# EasyEDA schematic LCEDA_schematic_esp_trans_v2.json

## Sheets
1 Sheet_1: TITLE: Sheet_1; REV: 1.0; Date: 2023-03-05; Sheet: 1/2; Drawn By: gtwhhh; Company: gtwhhh
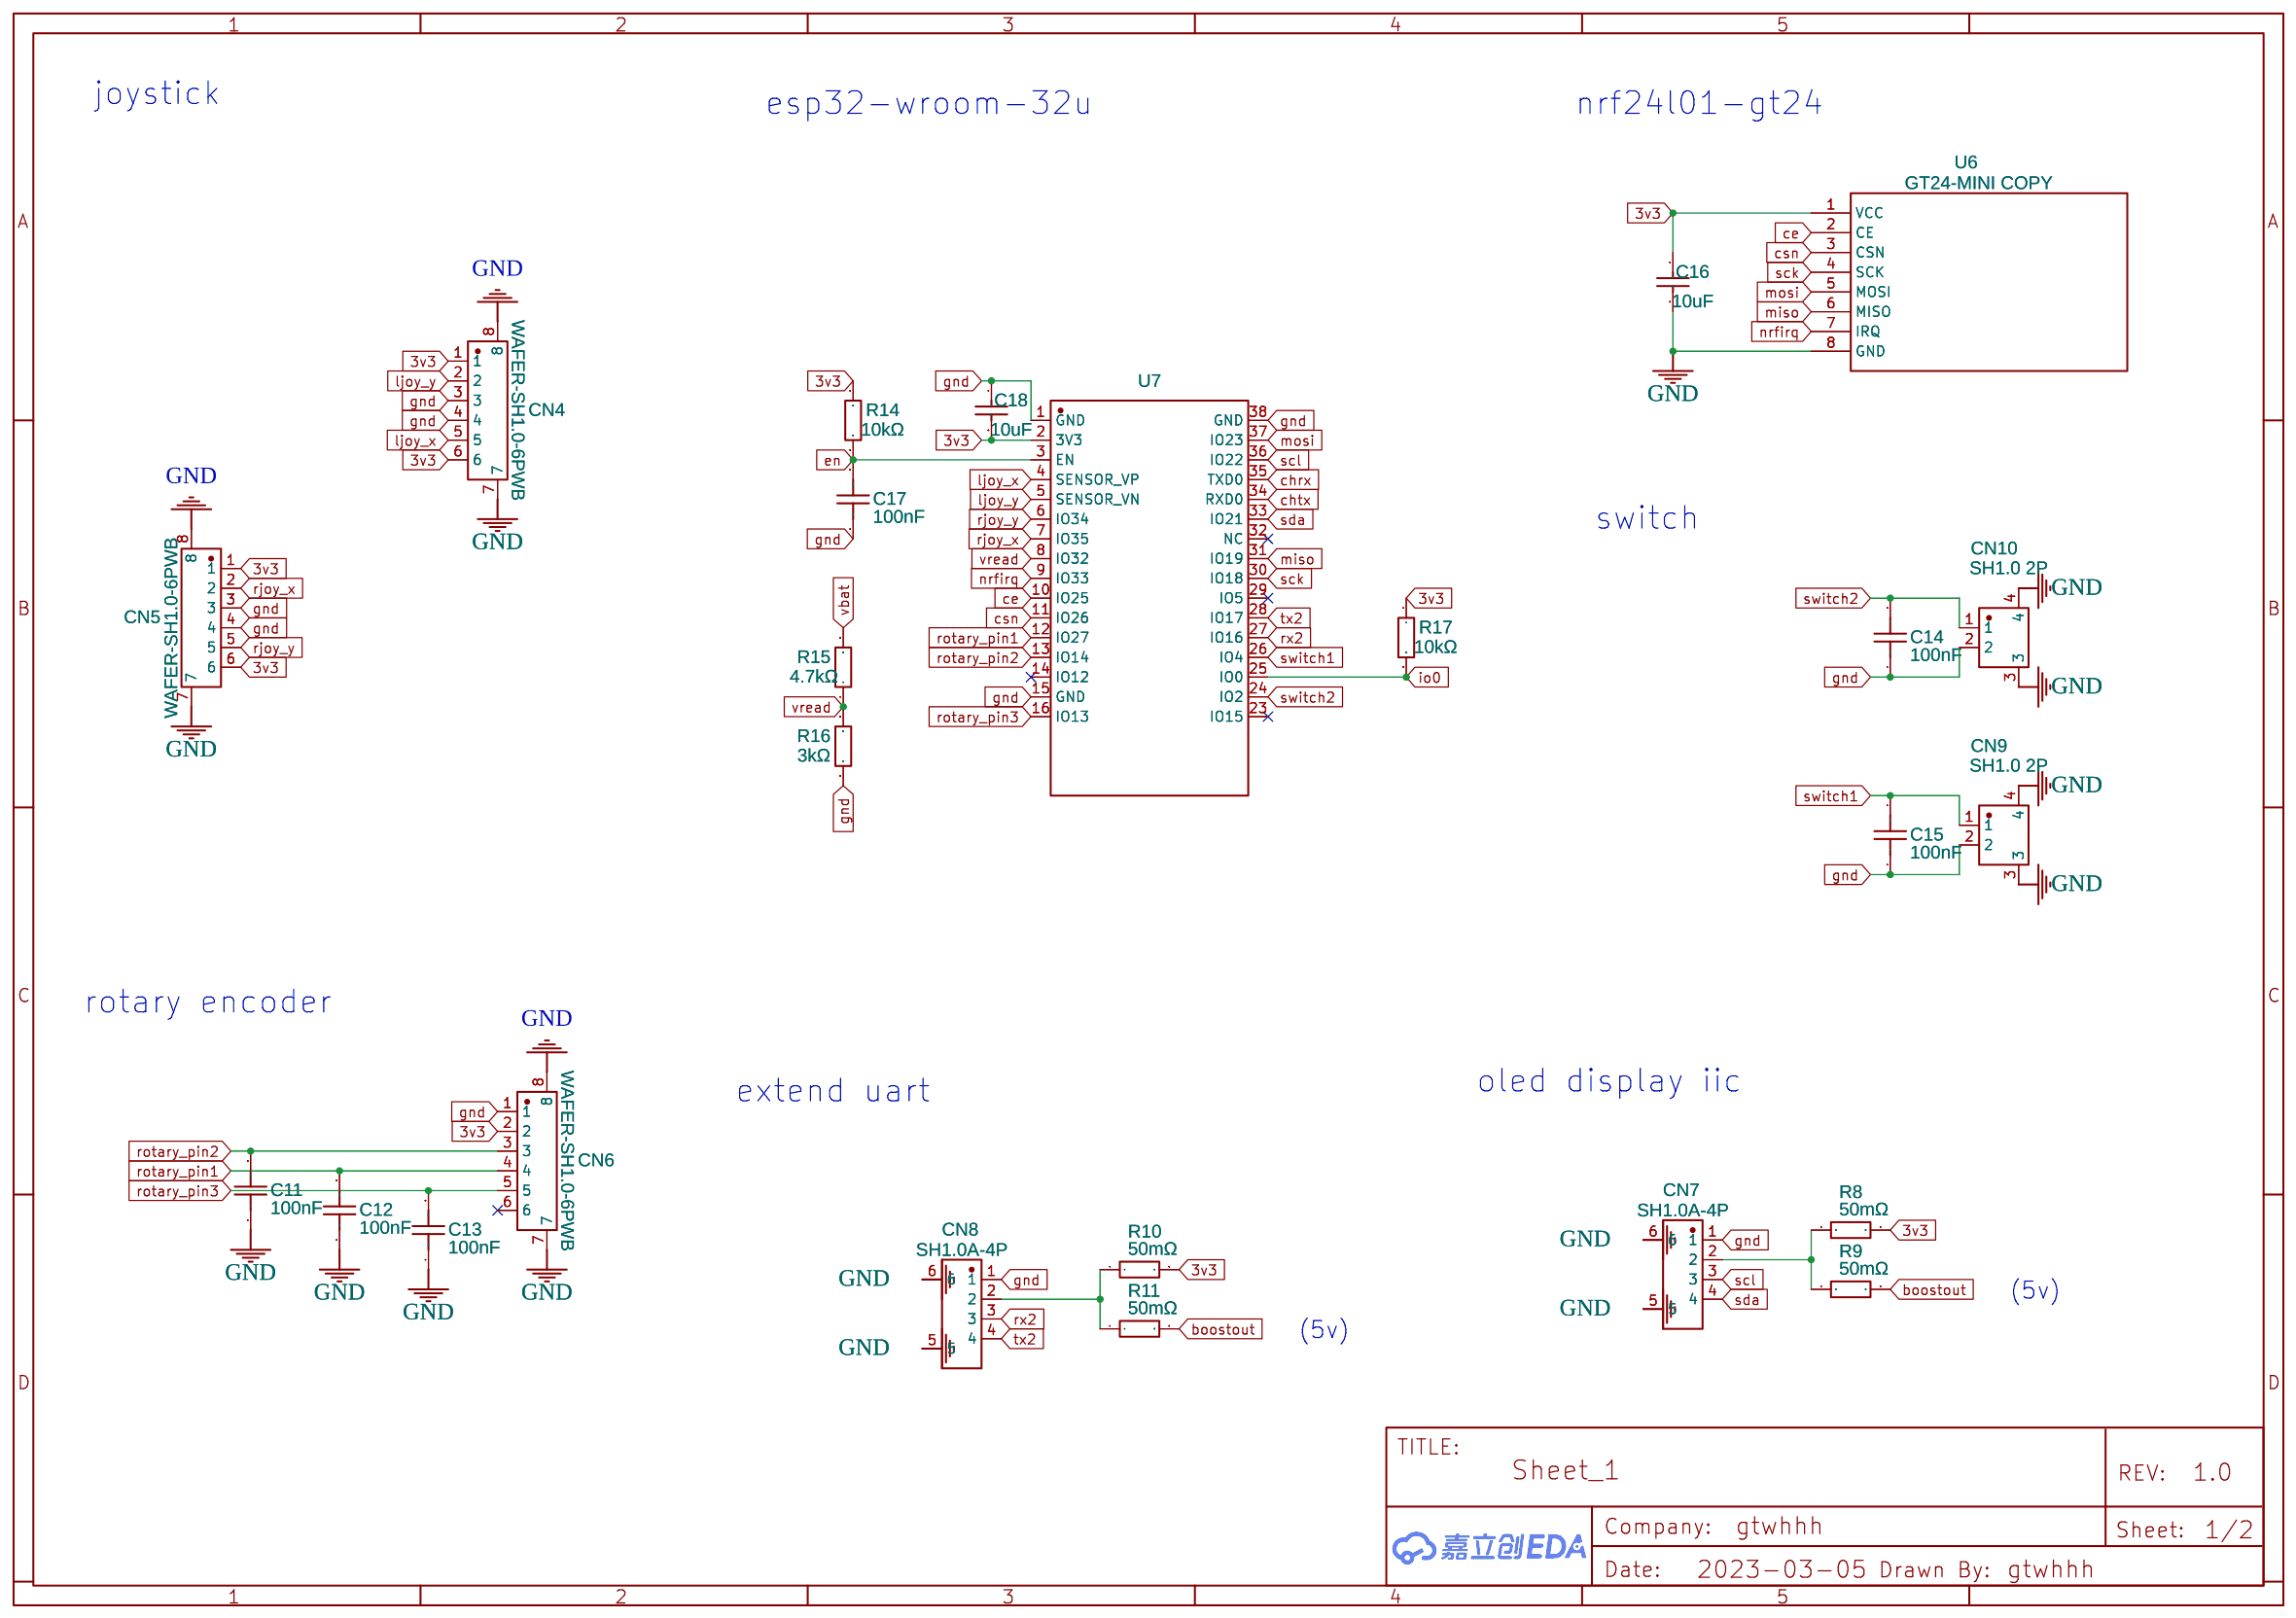
[diagram p0: Sheet_1]
2 Sheet_2: TITLE: Sheet_2; Sheet: 2/2
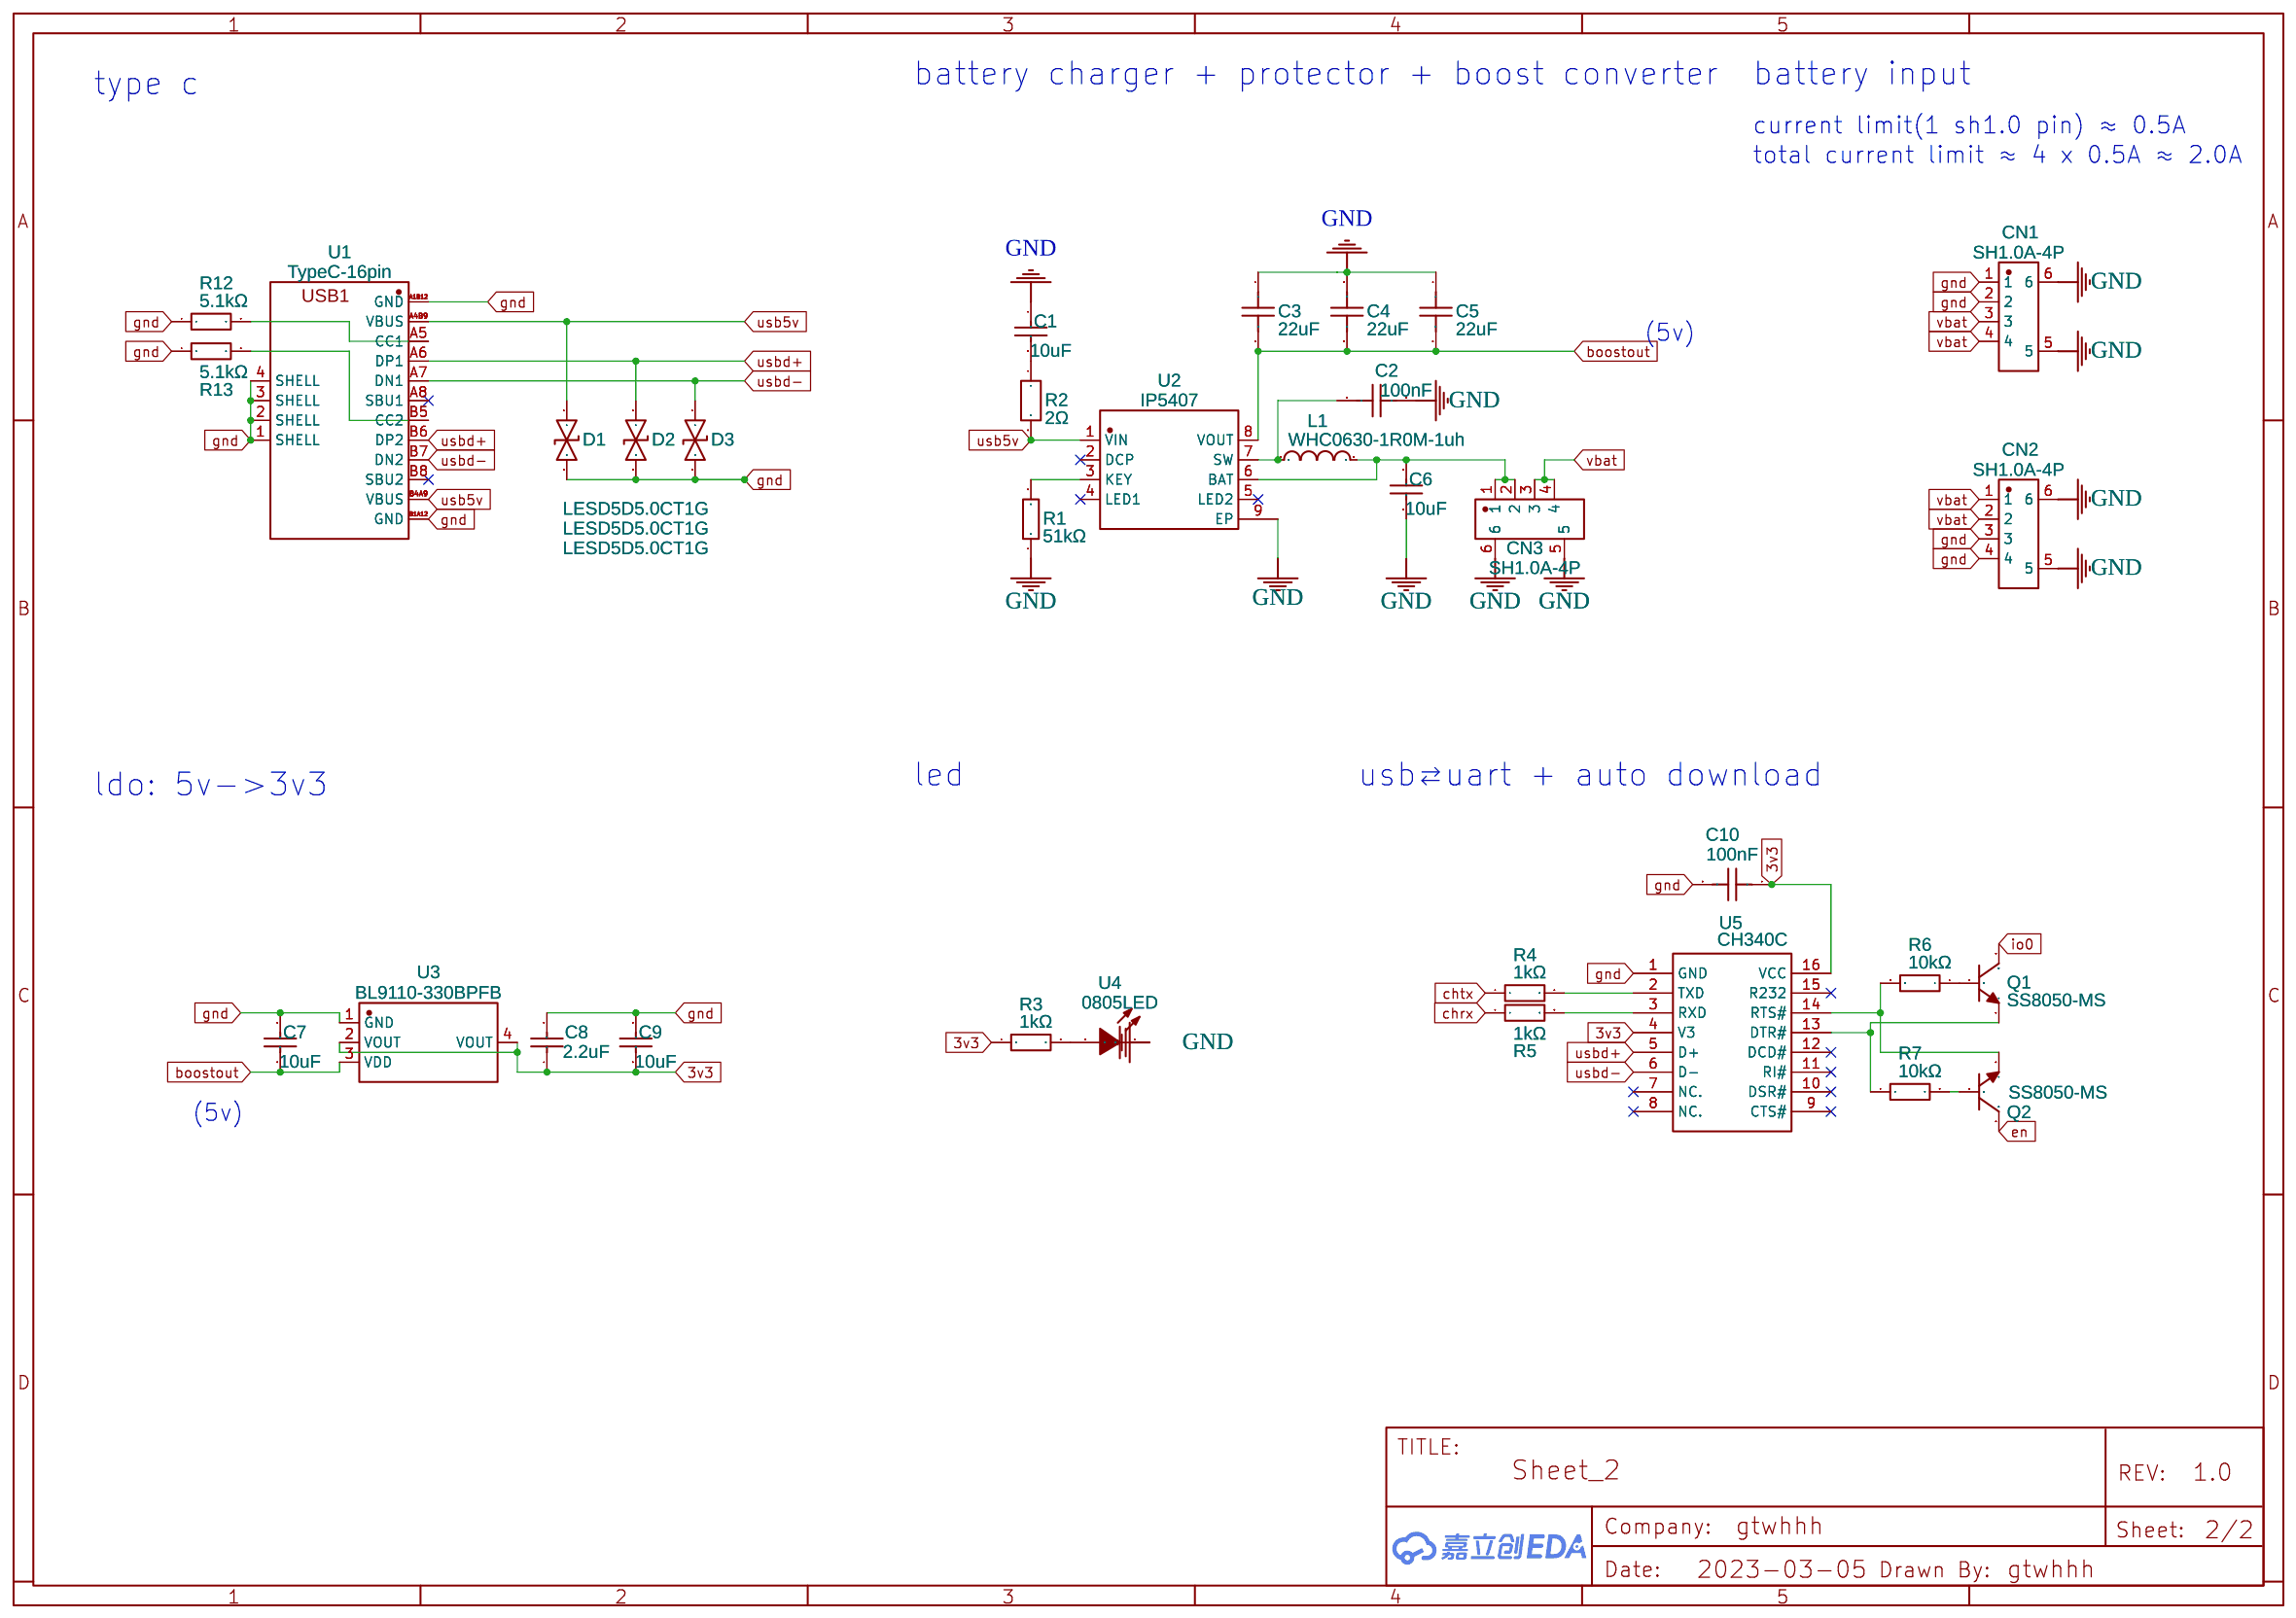
[diagram p1: Sheet_2]

## Parts
sheet Sheet_1
C11  100nF  [C0805]
C12  100nF  [C0805]
C13  100nF  [C0805]
C14  100nF  [C0805]
C15  100nF  [C0805]
C16  10uF  [C0805]
C17  100nF  [C0805]
C18  10uF  [C0805]
CN4  WAFER-SH1.0-6PWB  [CONN-SMD_6P-P1.00_XUNPU_WAFER-SH1.0-6PWB]
CN5  WAFER-SH1.0-6PWB  [CONN-SMD_6P-P1.00_XUNPU_WAFER-SH1.0-6PWB]
CN6  WAFER-SH1.0-6PWB  [CONN-SMD_6P-P1.00_XUNPU_WAFER-SH1.0-6PWB]
CN7  SH1.0A-4P  [CONN-SMD_SH1.0A-4P-WT]
CN8  SH1.0A-4P  [CONN-SMD_SH1.0A-4P-WT]
CN9  SH1.0 2P  [EPHB_CONN-SMD_2P-P1.00_XUNPU_WAFER-SH1.0-2PWB SH1.0 2P 卧贴]
CN10  SH1.0 2P  [EPHB_CONN-SMD_2P-P1.00_XUNPU_WAFER-SH1.0-2PWB SH1.0 2P 卧贴]
R8  50mΩ  [R0805]
R9  50mΩ  [R0805]
R10  50mΩ  [R0805]
R11  50mΩ  [R0805]
R14  10kΩ  [R0805]
R15  4.7kΩ  [R0805]
R16  3kΩ  [R0805]
R17  10kΩ  [R0805]
U6  GT24-MINI COPY  [GT24-MINI]
U7  NO  [ESP32,M]
sheet Sheet_2
C1  10uF  [C0805]
C2  100nF  [C0805]
C3  22uF  [C0805]
C4  22uF  [C0805]
C5  22uF  [C0805]
C6  10uF  [C0805]
C7  10uF  [C0805]
C8  2.2uF  [C0805]
C9  10uF  [C0805]
C10  100nF  [C0805]
CN1  SH1.0A-4P  [CONN-SMD_SH1.0A-4P-WT]
CN2  SH1.0A-4P  [CONN-SMD_SH1.0A-4P-WT]
CN3  SH1.0A-4P  [CONN-SMD_SH1.0A-4P-WT]
D1  LESD5D5.0CT1G  [SOD-523_L1.2-W0.8-LS1.6-BI]
D2  LESD5D5.0CT1G  [SOD-523_L1.2-W0.8-LS1.6-BI]
D3  LESD5D5.0CT1G  [SOD-523_L1.2-W0.8-LS1.6-BI]
L1  WHC0630-1R0M-1uh  [0630电感]
Q1  SS8050-MS  [SOT-23-3_L2.9-W1.6-P1.90-LS2.8-BR]
Q2  SS8050-MS  [SOT-23-3_L2.9-W1.6-P1.90-LS2.8-BR]
R1  51kΩ  [R0805]
R2  2Ω  [R0805]
R3  1kΩ  [R0805]
R4  1kΩ  [R0805]
R5  1kΩ  [R0805]
R6  10kΩ  [R0805]
R7  10kΩ  [R0805]
R12  5.1kΩ  [R0805]
R13  5.1kΩ  [R0805]
U1  TypeC-16pin  [TYPEC-16PIN]
U2  IP5407  [ESOP-8_L4.9-W3.9-P1.27-LS6.0-BL-EP2.0]
U3  BL9110-330BPFB  [SOT-223_L6.5-W3.5-P2.30-LS7.0-BR]
U4  0805LED  [LED0805-RD_WHITE]
U5  CH340C  [SOP-16_L10.0-W3.9-P1.27-LS6.0-BL]

## Library data of the parts
C2 C10-C15 C17 = 0805B104K500: Supplier: LCSC; Manufacturer: Walsin(华新科); Manufacturer Part: 0805B104K500CT; Supplier Part: C83055; JLCPCB Part Class: Extended Part; link: https://so.szlcsc.com/global.html?k=C83055&ref=editor
C1 C6 C7 C9 C16 C18 = 0805X106K250NT: Supplier: LCSC; Manufacturer: FH(风华); Supplier Part: C40894; JLCPCB Part Class: Extended Part; link: https://so.szlcsc.com/global.html?k=C40894&ref=editor
CN4-CN6 = WAFER-SH1.0-6PWB: Supplier: LCSC; Supplier Part: C3029345; Manufacturer: XUNPU(讯普); link: https://atta.szlcsc.com/upload/public/pdf/source/20220527/1879B8210BD3B2006BCEAC1A40D397B6.pdf; Contributor: lcsc; JLCPCB Part Class: Extended Part
CN1-CN3 CN7 CN8 = SH1.0A-4P 卧贴: Supplier: LCSC; Supplier Part: C9900000720; Manufacturer: null; JLCPCB Part Class: Extended Part; Contributor: LCSC
CN9 CN10 = EPHB_WAFER-SH1.0-2PWB COPY1 SH1.0 2P 卧贴: Supplier: LCSC; Supplier Part: C3029341; Manufacturer: XUNPU(讯普); Manufacturer Part: WAFER-SH1.0-2PWB; link: https://atta.szlcsc.com/upload/public/pdf/source/20220527/1879B8210BD3B2006BCEAC1A40D397B6.pdf; Contributor: lcsc
R8-R11 = RL0805FR-070R05L: Contributor: LCSC; Supplier: LCSC; Supplier Part: C309624; Manufacturer: YAGEO(国巨); JLCPCB Part Class: Extended Part; link: https://so.szlcsc.com/global.html?k=C309624&ref=editor
R6 R7 R14 R17 = AC0805FR-0710KL: Contributor: LCSC; Supplier: LCSC; Manufacturer: YAGEO(国巨); Supplier Part: C140868; JLCPCB Part Class: Extended Part; link: https://so.szlcsc.com/global.html?k=C140868&ref=editor
R15 = RC0805JR-074K7L: Supplier: LCSC; Manufacturer: YAGEO(国巨); Supplier Part: C105427; JLCPCB Part Class: Extended Part; link: https://so.szlcsc.com/global.html?k=C105427&ref=editor
R16 = RC0805FR-073KL: Supplier: LCSC; Manufacturer: YAGEO(国巨); Supplier Part: C126350; JLCPCB Part Class: Extended Part; link: https://so.szlcsc.com/global.html?k=C126350&ref=editor
U6 = GT24-MINI COPY: Contributor: qinyong612
U7 = esp3232: Manufacturer: 123; Manufacturer Part: 123; Supplier Part: 123; link: 123; Contributor: ivochen214
C3-C5 = 0805X226M160NT: Contributor: LCSC; Supplier: LCSC; Manufacturer: FH(风华); Supplier Part: C129302; JLCPCB Part Class: Extended Part; link: https://so.szlcsc.com/global.html?k=C129302&ref=editor
C8 = 0805B225K250NT: Supplier: LCSC; Manufacturer: FH(风华); Supplier Part: C74690; JLCPCB Part Class: Extended Part; link: https://so.szlcsc.com/global.html?k=C74690&ref=editor
D1-D3 = LESD5D5.0CT1G: Supplier: LCSC; Supplier Part: C383211; Manufacturer: LRC(乐山无线电); Contributor: LCSC; JLCPCB Part Class: Extended Part
L1 = 0630-1R0电感: Supplier: LCSC; Supplier Part: C268399; Manufacturer: MAZO; Manufacturer Part: MPCA-0630-1R0-M; Contributor: liuliubilc; JLCPCB Part Class: Extended Part
Q1 Q2 = SS8050-MS: Supplier: LCSC; Supplier Part: C5120748; Manufacturer: MSKSEMI(美森科); link: https://atta.szlcsc.comnull; Contributor: lcsc; JLCPCB Part Class: Extended Part
R1 = RC0805FR-0751KL: Supplier: LCSC; Manufacturer: YAGEO(国巨); Supplier Part: C107233; JLCPCB Part Class: Extended Part; link: https://so.szlcsc.com/global.html?k=C107233&ref=editor
R2 = RT0805BRD072RL: Supplier: LCSC; Supplier Part: C723591; Manufacturer: YAGEO(国巨); Contributor: LCSC; JLCPCB Part Class: Extended Part
R3-R5 = RC0805FR-071KL: Supplier: LCSC; Manufacturer: YAGEO(国巨); Supplier Part: C95781; JLCPCB Part Class: Extended Part; link: https://so.szlcsc.com/global.html?k=C95781&ref=editor
R12 R13 = AC0805FR-075K1L: Contributor: LCSC; Supplier: LCSC; Manufacturer: YAGEO(国巨); Supplier Part: C144553; JLCPCB Part Class: Extended Part; link: https://so.szlcsc.com/global.html?k=C144553&ref=editor
U1 = TypeC-16pin: Contributor: yinzihui
U2 = IP5407: Supplier: LCSC; Supplier Part: C2890537; Manufacturer: null; JLCPCB Part Class: Extended Part; Contributor: LCSC
U3 = BL9110-330BPFB: Supplier: LCSC; Manufacturer: BL(上海贝岭); Contributor: LCSC; Supplier Part: C169246; JLCPCB Part Class: Extended Part
U4 = 白光0805LED: Supplier: LCSC; Supplier Part: C9900017662; Manufacturer: null; JLCPCB Part Class: Extended Part; Contributor: lcsc
U5 = CH340C: Supplier: LCSC; Manufacturer: WCH(南京沁恒); Supplier Part: C84681; JLCPCB Part Class: Extended Part

## Nets
3v3: C8.1 C9.2 C10.1 C16.1 C18.2 CN4.1 CN4.6 CN5.1 CN5.6 CN6.2 R3.1 R8.2 R10.2 R14.1 R17.1 U3.2(VOUT) U3.4(VOUT) U5.4(V3) U5.16(VCC) U6.1(VCC) U7.2(3V3)
gnd: C7.1 C8.2 C9.1 C10.2 C14.1 C15.1 C17.1 C18.1 CN1.1 CN1.2 CN2.3 CN2.4 CN4.3 CN4.4 CN5.3 CN5.4 CN6.1 CN7.1 CN8.1 CN9.2 CN10.2 D1.2 D2.2 D3.2 R12.1 R13.1 R16.1 U1.1(SHELL) U1.2(SHELL) U1.3(SHELL) U1.4(SHELL) U1.A1B12(GND) U1.B1A12(GND) U3.1(GND) U5.1(GND) U7.1(GND) U7.15(GND) U7.38(GND)
GND: C1.1 C2.1 C3.1 C4.1 C5.1 C6.2 C11.1 C12.1 C13.1 C16.2 CN1.5 CN1.6 CN2.5 CN2.6 CN3.5 CN3.6 CN4.7 CN4.8 CN5.7 CN5.8 CN6.7 CN6.8 CN7.5 CN7.6 CN8.5 CN8.6 CN9.3 CN9.4 CN10.3 CN10.4 R1.1 U2.9(EP) U4.1(C) U6.8(GND)
vbat: CN1.3 CN1.4 CN2.1 CN2.2 CN3.3 CN3.4 R15.2
boostout: C3.2 C4.2 C5.2 C7.2 R9.2 R11.2 U2.8(VOUT) U3.3(VDD)
ce: U6.2(CE) U7.10(IO25)
chrx: R5.1 U7.35(TXD0)
chtx: R4.1 U7.34(RXD0)
csn: U6.3(CSN) U7.11(IO26)
en: C17.2 Q2.3(C) R14.2 U7.3(EN)
io0: Q1.3(C) R17.2 U7.25(IO0)
ljoy_x: CN4.5 U7.4(SENSOR_VP)
ljoy_y: CN4.2 U7.5(SENSOR_VN)
miso: U6.6(MISO) U7.31(IO19)
mosi: U6.5(MOSI) U7.37(IO23)
nrfirq: U6.7(IRQ) U7.9(IO33)
rjoy_x: CN5.2 U7.7(IO35)
rjoy_y: CN5.5 U7.6(IO34)
rotary_pin1: C12.2 CN6.4 U7.12(IO27)
rotary_pin2: C11.2 CN6.3 U7.13(IO14)
rotary_pin3: C13.2 CN6.5 U7.16(IO13)
rx2: CN8.3 U7.27(IO16)
sck: U6.4(SCK) U7.30(IO18)
scl: CN7.3 U7.36(IO22)
sda: CN7.4 U7.33(IO21)
switch1: C15.2 CN9.1 U7.26(IO4)
switch2: C14.2 CN10.1 U7.24(IO2)
tx2: CN8.4 U7.28(IO17)
usb5v: D1.1 R2.2 U1.A4B9(VBUS) U1.B4A9(VBUS) U2.1(VIN)
usbd+: D2.1 U1.A6(DP1) U1.B6(DP2) U5.5(D+)
usbd-: D3.1 U1.A7(DN1) U1.B7(DN2) U5.6(D-)
vread: R15.1 R16.2 U7.8(IO32)
Net-(C1-2): C1.2 R2.1
Net-(C2-2): C2.2 L1.1 U2.7(SW)
Net-(C6-1): C6.1 CN3.1 CN3.2 L1.2 U2.6(BAT)
Net-(CN7-2): CN7.2 R8.1 R9.1
Net-(CN8-2): CN8.2 R10.1 R11.1
Net-(Q1-1): Q1.1(B) R6.1
Net-(Q1-2): Q1.2(E) R7.1 U5.13(DTR#)
Net-(Q2-1): Q2.1(B) R7.2
Net-(Q2-2): Q2.2(E) R6.2 U5.14(RTS#)
Net-(R1-2): R1.2 U2.3(KEY)
Net-(R3-2): R3.2 U4.2(A)
Net-(R4-2): R4.2 U5.2(TXD)
Net-(R5-2): R5.2 U5.3(RXD)
Net-(R12-2): R12.2 U1.A5(CC1)
Net-(R13-2): R13.2 U1.B5(CC2)

Not connected (* = marked no-connect by the designer): CN6 6*; U1 A8(SBU1)* B8(SBU2)*; U2 2(DCP)* 4(LED1)* 5(LED2)*; U5 7(NC.)* 8(NC.)* 9(CTS#)* 10(DSR#)* 11(RI#)* 12(DCD#)* 15(R232)*; U7 14(IO12)* 23(IO15)* 29(IO5)* 32(NC)*

## Notes on the sheets
sheet 1
- joystick
- esp32-wroom-32u
- nrf24l01-gt24
- switch
- rotary encoder
- oled display iic
- extend uart
- (5v)
- (5v)
sheet 2
- type c
- battery charger + protector + boost converter
- battery input
- current limit(1 sh1.0 pin) ≈ 0.5A
- total current limit ≈ 4 x 0.5A ≈ 2.0A
- (5v)
- ldo: 5v->3v3
- led
- usb⇄uart + auto download
- (5v)
